# Altium schematic sheet CONNECTORS.SchDoc: CONNECTORS
size A4; Engineer: M.GUENI; Revision: R0; SheetNumber: 5; SheetTotal: 5
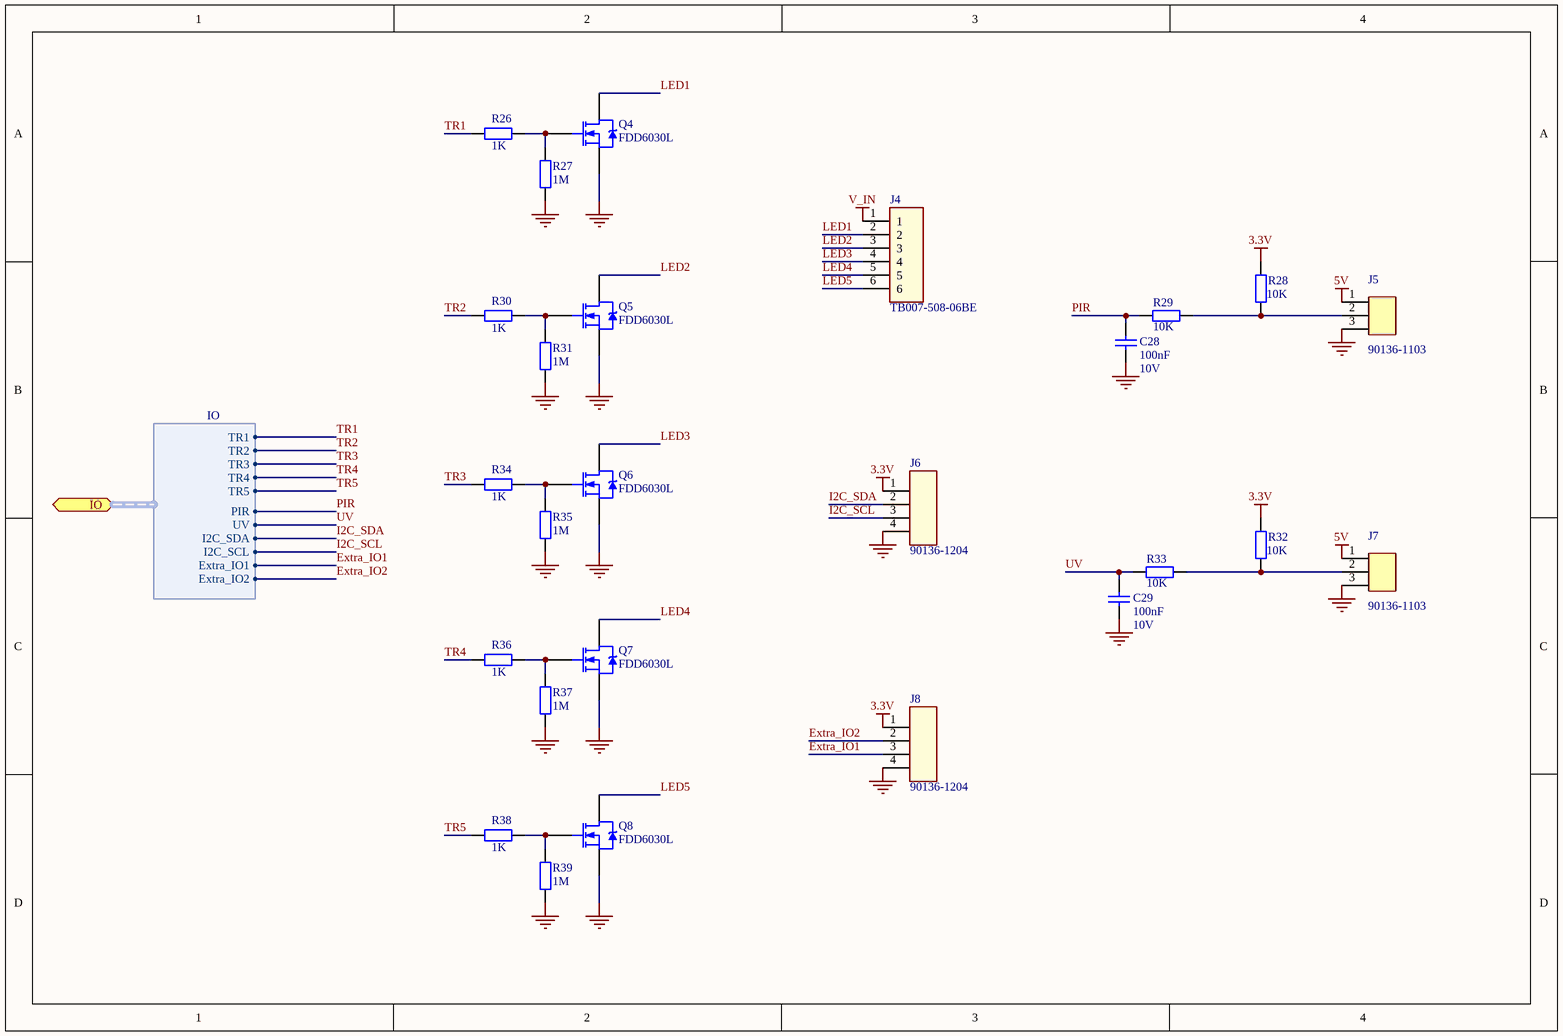
[diagram p0: CONNECTORS.SchDoc]

## Parts
C28  Value 1: 100nF  Value 2: 10V  [CAPC1608N]  (hidden comment: Capacitor)
C29  Value 1: 100nF  Value 2: 10V  [CAPC1608N]  (hidden comment: Capacitor)
J4  TB007-508-06BE  [HDR1X6]
J5  90136-1103  [HDR1X3]
J6  90136-1204  [HDR1X4]
J7  90136-1103  [HDR1X3]
J8  90136-1204  [HDR1X4]
Q4  FDD6030L  [TO-252-3]
Q5  FDD6030L  [TO-252-3]
Q6  FDD6030L  [TO-252-3]
Q7  FDD6030L  [TO-252-3]
Q8  FDD6030L  [TO-252-3]
R26  Value 1: 1K  [RESC1608N]  (hidden comment: Resistor)
R27  Value 1: 1M  [RESC1608N]  (hidden comment: Resistor)
R28  Value 1: 10K  [RESC1608N]  (hidden comment: Resistor)
R29  Value 1: 10K  [RESC1608N]  (hidden comment: Resistor)
R30  Value 1: 1K  [RESC1608N]  (hidden comment: Resistor)
R31  Value 1: 1M  [RESC1608N]  (hidden comment: Resistor)
R32  Value 1: 10K  [RESC1608N]  (hidden comment: Resistor)
R33  Value 1: 10K  [RESC1608N]  (hidden comment: Resistor)
R34  Value 1: 1K  [RESC1608N]  (hidden comment: Resistor)
R35  Value 1: 1M  [RESC1608N]  (hidden comment: Resistor)
R36  Value 1: 1K  [RESC1608N]  (hidden comment: Resistor)
R37  Value 1: 1M  [RESC1608N]  (hidden comment: Resistor)
R38  Value 1: 1K  [RESC1608N]  (hidden comment: Resistor)
R39  Value 1: 1M  [RESC1608N]  (hidden comment: Resistor)

## Ports
IO (bidir, harness IO)

## Harnesses
IO: TR1, TR2, TR3, TR4, TR5, PIR, UV, I2C_SDA, I2C_SCL, Extra_IO1, Extra_IO2

## Nets
3.3V: J6.1 J8.1 R28.2 R32.2
5V: J5.1 J7.1
GND: C28.1 C29.1 J5.3 J6.4 J7.3 J8.4 Q4.3(S) Q5.3(S) Q6.3(S) Q7.3(S) Q8.3(S) R27.1 R31.1 R35.1 R37.1 R39.1
V_IN: J4.1
Extra_IO1: J8.3 ; port IO.Extra_IO1
Extra_IO2: J8.2 ; port IO.Extra_IO2
I2C_SCL: J6.3 ; port IO.I2C_SCL
I2C_SDA: J6.2 ; port IO.I2C_SDA
LED1: J4.2 Q4.4(D)
LED2: J4.3 Q5.4(D)
LED3: J4.4 Q6.4(D)
LED4: J4.5 Q7.4(D)
LED5: J4.6 Q8.4(D)
PIR: C28.2 R29.2 ; port IO.PIR
TR1: R26.1 ; port IO.TR1
TR2: R30.1 ; port IO.TR2
TR3: R34.1 ; port IO.TR3
TR4: R36.1 ; port IO.TR4
TR5: R38.1 ; port IO.TR5
UV: C29.2 R33.2 ; port IO.UV
NetJ5_2: J5.2 R28.1 R29.1
NetJ7_2: J7.2 R32.1 R33.1
NetQ4_1: Q4.1(G) R26.2 R27.2
NetQ5_1: Q5.1(G) R30.2 R31.2
NetQ6_1: Q6.1(G) R34.2 R35.2
NetQ7_1: Q7.1(G) R36.2 R37.2
NetQ8_1: Q8.1(G) R38.2 R39.2

## Notes on the sheet
- Title:
- Micro Device Tunisie
- Size:
- Date:
- File:
- A4
- Engineer :
- Revision:
- Sheet
- of
- Cyber Parc  Hammam Sousse
- Avenue Charles De Gaulle
- 4011, Hammam-Sousse, Tunisie
- contact@mdtunisie.com

## Library data of the parts
C28 C29 = CAP-000000005: MAN: KEMET; MANREF: C0603X104K8RACTU; DES: C0603X104K8RACTU -  Condensateur céramique multicouche CMS, 0.1 µF, 10 V, 0603 [1608 Metric], ± 10%, X7R; TOL: 10%; FTP: 0603; SUP: Farnell; SUPREF: 2904937; NOTE: _; Part Number: CAP-000000005
J4 = CON-000000007: MAN: CUI Devices; DES: Borniers fixes Terminal block, screw type, 5.08 , horizontal, 6 poles, CUI Blue, slotted screw, PCB mount; Value 1: 6pts; Value 2: _; FTP: THT; SUP: Mouser; SUPREF: 490-TB007-508-06BE; Part Number: CON-000000007; MANREF: TB007-508-06BE; TOL: _; NOTE: _
J5 J7 = CON-000000003: MAN: Molex; DES: Headers & Wire Housings 2.54MM CGRIDIII HDR 3P V SR SHRD TIN; Value 1: 3pts; Value 2: 2,54 mm; TOL: _; FTP: THT; SUP: Mouser; SUPREF: 538-90136-1103; Part Number: CON-000000003; MANREF: 90136-1103; NOTE: _
J6 J8 = CON-000000004: MAN: Molex; DES: Headers & Wire Housings 2.54MM CGRIDIII HDR 4P V SR SHRD AU-E; Value 1: 4pts; Value 2: 2,54 mm; TOL: _; FTP: THT; SUP: Mouser; SUPREF: 538-90136-1204; Part Number: CON-000000004; MANREF: 90136-1204; NOTE: _
Q4-Q8 = TRM-000000001: MAN: ON Semiconductor / Fairchild; DES: MOSFET 30V N-Channel Power Trench; Value 1: 50 A; Value 2: 30 V; TOL: _; SUP: Mouser; SUPREF: 512-FDD6030L; Part Number: TRM-000000001; MANREF: FDD6030L; FTP: TO-252-3; NOTE: _
R26 R30 R34 R36 R38 = RES-000000006: MAN: TE Connectivity / Neohm; MANREF: CPF0603F1K0C1; DES: Thin Film Resistors - SMD 1KOhm .063W 50PPM; Value 2: 0.625W; TOL: 1%; FTP: 0603; SUP: Mouser; SUPREF: 279-CPF0603F1K0C1; NOTE: _; Part Number: RES-000000006
R27 R31 R35 R37 R39 = RES-000000010: MAN: WELWYN; MANREF: ASC0603-1M0FT5; DES: ASC0603-1M0FT5 -  Résistance à puce CMS, Couche épaisse, 1 Mohm, 50 V, Couche épaisse, 0603 [1608 Metric], 100 mW; Value 2: 0.1W; TOL: 1%; FTP: 0603; SUP: Farnell; SUPREF: 2078928; NOTE: _; Part Number: RES-000000010
R28 R29 R32 R33 = RES-000000001: MAN: YAGEO; MANREF: RC0603FR-0710KL; DES: YAGEO (PHYCOMP)  RC0603FR-0710KL  RESISTANCE COUCHE EPAISSE 10K 0.1W 1%; Value 2: 0.1W; TOL: 1%; FTP: 0603; SUP: Farnell; SUPREF: 9238603; NOTE: _; Part Number: RES-000000001